# Altium schematic sheet STM32_Sensors.SchDoc
size A; SheetNumber: 4; SheetTotal: 4
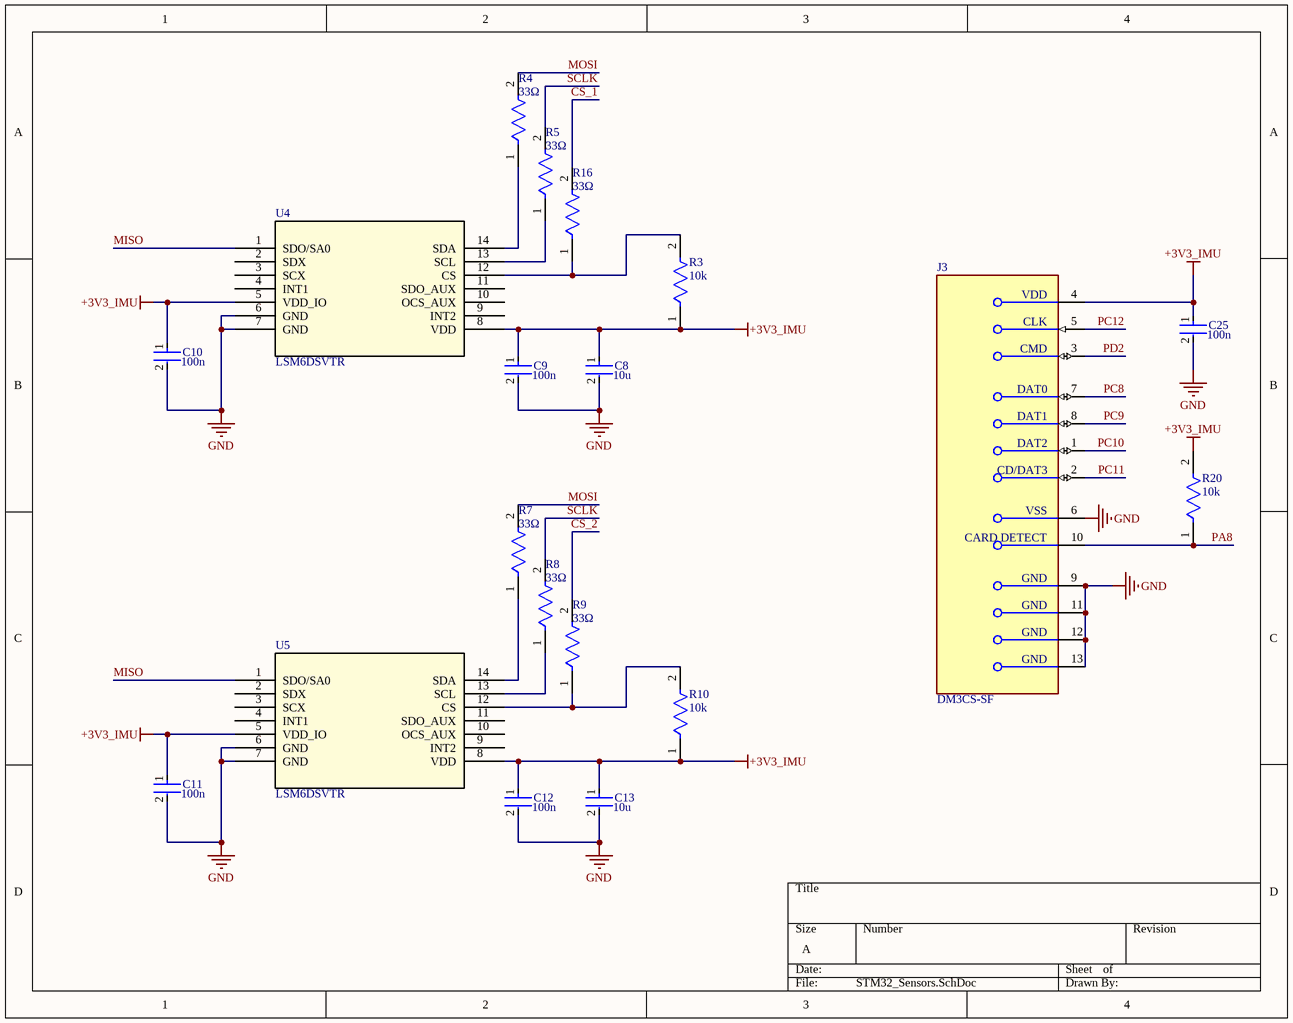
[diagram p0: STM32_Sensors.SchDoc]

## Parts
C8  Capacitance: 10u  [FP-CC0603-DC-MFG]  (hidden comment: CC0603KRX5R7BB106)
C9  Capacitance: 100n  [FP-0603B104K250CT-IPC_C]  (hidden comment: 0603B104K250CT)
C10  Capacitance: 100n  [FP-0603B104K250CT-IPC_C]  (hidden comment: 0603B104K250CT)
C11  Capacitance: 100n  [FP-0603B104K250CT-IPC_C]  (hidden comment: 0603B104K250CT)
C12  Capacitance: 100n  [FP-0603B104K250CT-IPC_C]  (hidden comment: 0603B104K250CT)
C13  Capacitance: 10u  [FP-CC0603-DC-MFG]  (hidden comment: CC0603KRX5R7BB106)
C25  Capacitance: 100n  [FP-0603B104K250CT-IPC_C]  (hidden comment: 0603B104K250CT)
J3  DM3CS-SF  [FP-DM3CS-SF-MFG]
R3  value 10k  [FP-AC0603-IPC_A]  (hidden comment: AC0603JR-7W10KL)
R4  value 33Ω  [FP-SR0603-MFG]  (hidden comment: SR0603FR-7T33RL)
R5  Resistance: 33Ω  [FP-SR0603-MFG]  (hidden comment: SR0603FR-7T33RL)
R7  value 33Ω  [FP-SR0603-MFG]  (hidden comment: SR0603FR-7T33RL)
R8  Resistance: 33Ω  [FP-SR0603-MFG]  (hidden comment: SR0603FR-7T33RL)
R9  value 33Ω  [FP-SR0603-MFG]  (hidden comment: SR0603FR-7T33RL)
R10  value 10k  [FP-AC0603-IPC_A]  (hidden comment: AC0603JR-7W10KL)
R16  value 33Ω  [FP-SR0603-MFG]  (hidden comment: SR0603FR-7T33RL)
R20  value 10k  [FP-AC0603-IPC_A]  (hidden comment: AC0603JR-7W10KL)
U4  LSM6DSVTR  [LGA14-L_2P59X3P1X0P5_STM]
U5  LSM6DSVTR  [LGA14-L_2P59X3P1X0P5_STM]

## Nets
+3V3_IMU: C8.1 C9.1 C10.1 C11.1 C12.1 C13.1 C25.1 J3.4(VDD) R3.1 R10.1 R20.2 U4.5(VDD_IO) U4.8(VDD) U5.5(VDD_IO) U5.8(VDD)
GND: C8.2 C9.2 C10.2 C11.2 C12.2 C13.2 C25.2 J3.6(VSS) J3.9(GND) J3.11(GND) J3.12(GND) J3.13(GND) U4.6(GND) U4.7(GND) U5.6(GND) U5.7(GND)
CS_1: R16.2
CS_2: R9.2
MISO: U4.1(SDO/SA0) U5.1(SDO/SA0)
MOSI: R4.2 R7.2
PA8: J3.10(CARD_DETECT) R20.1
PC8: J3.7(DAT0)
PC9: J3.8(DAT1)
PC10: J3.1(DAT2)
PC11: J3.2(CD/DAT3)
PC12: J3.5(CLK)
PD2: J3.3(CMD)
SCLK: R5.2 R8.2
NetR3_2: R3.2 R16.1 U4.12(CS)
NetR4_1: R4.1 U4.14(SDA)
NetR5_1: R5.1 U4.13(SCL)
NetR7_1: R7.1 U5.14(SDA)
NetR8_1: R8.1 U5.13(SCL)
NetR9_1: R9.1 R10.2 U5.12(CS)

Not connected (* = marked no-connect by the designer): U4 2(SDX) 3(SCX) 4(INT1) 9(INT2) 10(OCS_AUX) 11(SDO_AUX); U5 2(SDX) 3(SCX) 4(INT1) 9(INT2) 10(OCS_AUX) 11(SDO_AUX)

## Library data of the parts
C8 C13 = CMP-00621-81932632-1: CC0603KRX5R7BB106 Multilayer Ceramic Capacitor, 10 uF, 16 V, ± 10%, X5R, 0603 [1608 Metric]; Voltage Rating: 16V; NexarPartId: 81932632; Height: 1mm; Halogen Free: Halogen Free; Dielectric: X5R; Max Operating Temperature: 85°C; Voltage Rating (DC): 16V; Material: Ceramic; Lead Free: Lead Free; Tolerance: 10%; RoHS: Non-Compliant; Min Operating Temperature: -55°C; Case/Package: 0603
C9-C12 C25 = CMP-45632-000009-1: CAP CER 0.1UF 25V X7R 0603; Tolerance: 10%; Voltage Rating (DC): 25V; Dielectric: X7R; Packaging: Tape and Reel; RoHS Compliant: Yes; Case Code (Imperial): 0603; Depth: 0.8mm; Voltage Rating: 25V; Case Code (Metric): 1608; Lead Free: Lead Free; Min Operating Temperature: -55°C; Max Operating Temperature: 125°C; Length: 1.6mm; Case/Package: Ceramic; Radiation Hardening: No
J3 = CMP-11597-000003-1: CONN MICRO SD CARD HINGED TYPE; Pitch: 1.1mm; Connector Type: Connector; Current Rating: 500mA; Voltage Rating (AC): 125V; Gender: Female; Insulation Resistance: 1GR; Number of Positions: 8; Contact Resistance: 100mR; Packaging: Tape and Reel; Flammability Rating: UL94 V-0; Lead Free: Lead Free; Min Operating Temperature: -25°C; Orientation: Right Angle; Width: 13.8mm; Number of Rows: 1; Housing Material: Polymer; Package Quantity: 1; Mount: Surface Mount; Max Current Rating: 500mA; Radiation Hardening: No; Max Operating Temperature: 85°C; Contact Plating: Gold; Depth: 1.83mm; Contact Material: Gold; Length: 14.1mm; Number of Contacts: 8; Termination: Solder
R3 R10 R20 = CMP-03412-040683-1: RES 10kΩ 5.00% 0.2W 0603
R4 R7 R9 R16 = CMP-03412-011068-1: RES 33 OHM 1% 1/4W 0603; Manufacturer: Yageo; Automotive Grade: Grade 0; Voltage Rating: 75V; Power Rating: 0.25W; Tolerance: 0.01; ComponentLink2Description: Datasheet; Device Class L1: Passive Components; Package: SR0603; Temperature: -55°C to +155°C; Composition: Thick Film; RoHS: TRUE; Resistance: 33Ω; Ipc Land Pattern Name: RESC16080X45; Automotive: Yes; Temperature Range Low: -55°C; Height: 0.55mm; Category: Res; Digikey Description: RES 33 OHM 1% 1/4W 0603; Manufacturer Part Number: SR0603FR-7T33RL; Series: SR; ComponentLink2URL: http://www.yageo.com/documents/recent/PYu-SR_D_F%20tol_RoHS_L_3.pdf; Device Class L2: Resistors; Temperature Range High: +155°C; Device Class L3: Chip SMD Resistors; Octopart: https://octopart.com/sr0603fr-7t33rl-yageo-92673856; Footprint Url: http://www.yageo.com/exep/pages/download/literatures/PYu-R_Mount_10.pdf; Lead Free: Yes
R5 R8 = CMP-03412-011068-1: RES 33 OHM 1% 1/4W 0603; Manufacturer: Yageo; Value: 33Ω; Automotive Grade: Grade 0; Voltage Rating: 75V; Power Rating: 0.25W; Tolerance: 0.01; ComponentLink2Description: Datasheet; Device Class L1: Passive Components; Package: SR0603; Temperature: -55°C to +155°C; Composition: Thick Film; RoHS: TRUE; Ipc Land Pattern Name: RESC16080X45; Automotive: Yes; Temperature Range Low: -55°C; Height: 0.55mm; Category: Res; Digikey Description: RES 33 OHM 1% 1/4W 0603; Manufacturer Part Number: SR0603FR-7T33RL; Series: SR; ComponentLink2URL: http://www.yageo.com/documents/recent/PYu-SR_D_F%20tol_RoHS_L_3.pdf; Device Class L2: Resistors; Temperature Range High: +155°C; Device Class L3: Chip SMD Resistors; Octopart: https://octopart.com/sr0603fr-7t33rl-yageo-92673856; Footprint Url: http://www.yageo.com/exep/pages/download/literatures/PYu-R_Mount_10.pdf; Lead Free: Yes
U4 U5 = LSM6DSVTR: 6-axis IMU with embedded sensor fusion, I3C, OIS/EIS for smart applications; Manufacturer_Name: STMicroelectronics; Copyright: Copyright (C) 2026 Ultra Librarian. All rights reserved.; Manufacturer_Part_Number: LSM6DSVTR; RefDes: RefDes; Type: Type